# Altium schematic sheet STM32F407开发板2.SchDoc
size A3
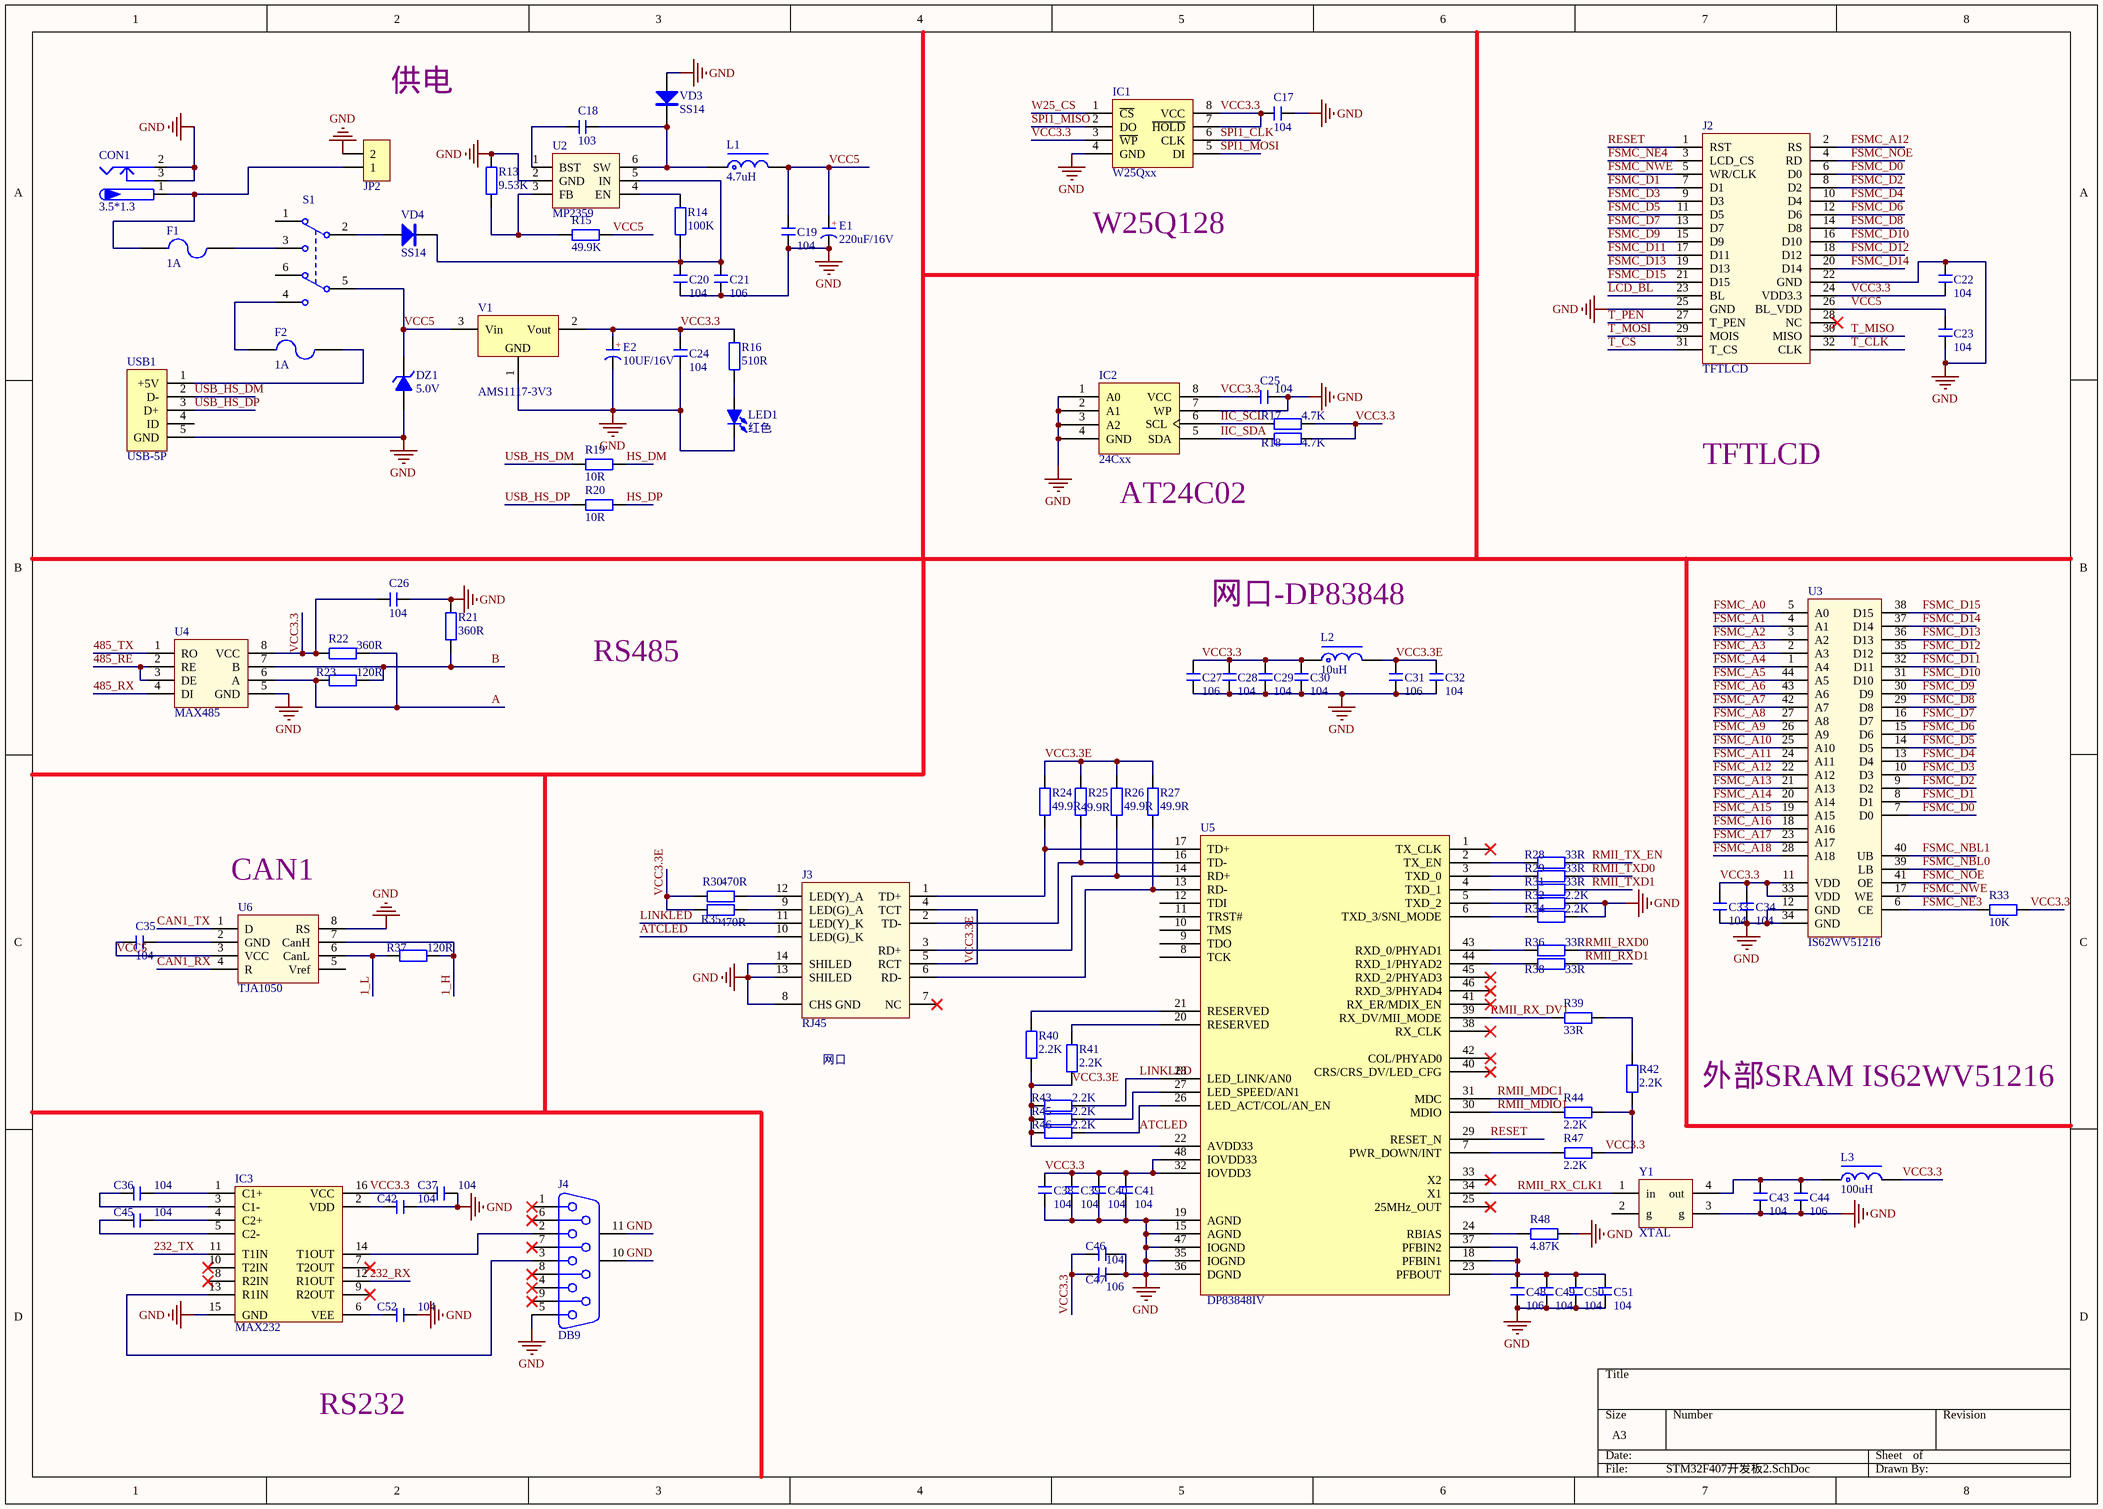
[diagram p0: STM32F407开发板2.SchDoc]

## Parts
C17  104  [C 0603]
C18  103  [C 0603]
C19  104  [C 0603]
C20  104  [C 0603]
C21  106  [C 0603]
C22  104  [C 0603]
C23  104  [C 0603]
C24  104  [C 0603]
C25  104  [C 0603]
C26  104  [C 0603]
C27  106  [C 0603]
C28  104  [C 0603]
C29  104  [C 0603]
C30  104  [C 0603]
C31  106  [C 0603]
C32  104  [C 0603]
C33  104  [C 0603]
C34  104  [C 0603]
C35  104  [C 0603]
C36  104  [C 0603]
C37  104  [C 0603]
C38  104  [C 0603]
C39  104  [C 0603]
C40  104  [C 0603]
C41  104  [C 0603]
C42  104  [C 0603]
C43  104  [C 0603]
C44  106  [C 0603]
C45  104  [C 0603]
C46  104  [C 0603]
C47  106  [C 0603]
C48  106  [C 0603]
C49  104  [C 0603]
C50  104  [C 0603]
C51  104  [C 0603]
C52  104  [C 0603]
CON1  3.5*1.3  [DC_5.5MM]
DZ1  5.0V  [MINI_MELF (LL34)]
E1  220uF/16V  [CM D(6.3*7.7)]
E2  10UF/16V  [C 1206]
F1  1A  [L 1206]
F2  1A  [L 1206]
IC1  W25Qxx  [SOP8W_L]
IC2  24Cxx  [SOP8_L]
IC3  MAX232  [SOP16_L]
J2  TFTLCD  [HDR-16X2]
J3  RJ45  [HR911105A]
J4  DB9  [DB9/P_A]
JP2  HDR-1X2  [KF301-2P]  (value not drawn)
L1  4.7uH  [L 0603]
L2  10uH  [L 0603]
L3  100uH  [L 0603]
LED1  红色  [LED 0603R]
R13  9.53K  [R 0603]
R14  100K  [R 0603]
R15  49.9K  [R 0603]
R16  510R  [R 0603]
R17  4.7K  [R 0603]
R18  4.7K  [R 0603]
R19  10R  [R 0603]
R20  10R  [R 0603]
R21  360R  [R 0603]
R22  360R  [R 0603]
R23  120R  [R 0603]
R24  49.9R  [R 0603]
R25  49.9R  [R 0603]
R26  49.9R  [R 0603]
R27  49.9R  [R 0603]
R28  33R  [R 0603]
R29  33R  [R 0603]
R30  470R  [R 0603]
R31  33R  [R 0603]
R32  2.2K  [R 0603]
R33  10K  [R 0603]
R34  2.2K  [R 0603]
R35  470R  [R 0603]
R36  33R  [R 0603]
R37  120R  [R 0603]
R38  33R  [R 0603]
R39  33R  [R 0603]
R40  2.2K  [R 0603]
R41  2.2K  [R 0603]
R42  2.2K  [R 0603]
R43  2.2K  [R 0603]
R44  2.2K  [R 0603]
R45  2.2K  [R 0603]
R46  2.2K  [R 0603]
R47  2.2K  [R 0603]
R48  4.87K  [R 0603]
S1  SK-22D02  [KFT DIP-8X8]  (value not drawn)
U2  MP2359  [MP2359]
U3  IS62WV51216  [IS62WV51216]
U4  MAX485  [MAX485]
U5  DP83848IV  [LQFP48 7X7_L]
U6  TJA1050  [TJA1050]
USB1  USB-5P  [USB-MINI-A]
V1  AMS1117-3V3  [SOT223_L]
VD3  SS14  [SOD-123]
VD4  SS14  [SOD-123]
Y1  XTAL  [XTAL-5032]

## Nets
GND: C17.1 C19.1 C20.1 C21.1 C22.1 C23.2 C24.1 C25.1 C26.1 C27.2 C28.2 C29.2 C30.2 C31.2 C32.2 C33.2 C34.2 C37.1 C38.2 C39.2 C40.2 C41.2 C42.1 C43.2 C44.2 C46.2 C47.2 C48.2 C49.2 C50.2 C51.2 C52.1 CON1.2 CON1.3 DZ1.1(A) E1.2(K) E2.2(K) IC1.4(GND) IC2.1(A0) IC2.2(A1) IC2.3(A2) IC2.4(GND) IC2.7(WP) IC3.15(GND) J2.22(GND) J2.25(GND) J3.8(CHS_GND) J3.13(SHILED) J3.14(SHILED) J4.5 J4.10(MH1) J4.11(MH2) JP2.2 LED1.2(K) R13.2 R21.1 R32.2 R34.2 R48.2 U2.2(GND) U3.12(GND) U3.34(GND) U4.5(GND) U5.15(AGND) U5.19(AGND) U5.35(IOGND) U5.36(DGND) U5.47(IOGND) U6.8(RS) USB1.5(GND) V1.1(GND) VD3.1(A) Y1.3(g)
1_H: R37.1 U6.7(CanH)
1_L: R37.2 U6.6(CanL)
232_RX: IC3.12(R1OUT)
232_TX: IC3.11(T1IN)
485_RE: U4.2(RE) U4.3(DE)
485_RX: U4.4(DI)
485_TX: U4.1(RO)
A: R22.1 R23.2 U4.6(A)
ATCLED: J3.10(LED(G)_K) R46.1 U5.26(LED_ACT/COL/AN_EN)
B: R21.2 R23.1 U4.7(B)
CAN1_RX: U6.4(R)
CAN1_TX: U6.1(D)
FSMC_A0: U3.5(A0)
FSMC_A1: U3.4(A1)
FSMC_A2: U3.3(A2)
FSMC_A3: U3.2(A3)
FSMC_A4: U3.1(A4)
FSMC_A5: U3.44(A5)
FSMC_A6: U3.43(A6)
FSMC_A7: U3.42(A7)
FSMC_A8: U3.27(A8)
FSMC_A9: U3.26(A9)
FSMC_A10: U3.25(A10)
FSMC_A11: U3.24(A11)
FSMC_A12: J2.2(RS) U3.22(A12)
FSMC_A13: U3.21(A13)
FSMC_A14: U3.20(A14)
FSMC_A15: U3.19(A15)
FSMC_A16: U3.18(A16)
FSMC_A17: U3.23(A17)
FSMC_A18: U3.28(A18)
FSMC_D0: J2.6(D0) U3.7(D0)
FSMC_D1: J2.7(D1) U3.8(D1)
FSMC_D2: J2.8(D2) U3.9(D2)
FSMC_D3: J2.9(D3) U3.10(D3)
FSMC_D4: J2.10(D4) U3.13(D4)
FSMC_D5: J2.11(D5) U3.14(D5)
FSMC_D6: J2.12(D6) U3.15(D6)
FSMC_D7: J2.13(D7) U3.16(D7)
FSMC_D8: J2.14(D8) U3.29(D8)
FSMC_D9: J2.15(D9) U3.30(D9)
FSMC_D10: J2.16(D10) U3.31(D10)
FSMC_D11: J2.17(D11) U3.32(D11)
FSMC_D12: J2.18(D12) U3.35(D12)
FSMC_D13: J2.19(D13) U3.36(D13)
FSMC_D14: J2.20(D14) U3.37(D14)
FSMC_D15: J2.21(D15) U3.38(D15)
FSMC_NBL0: U3.39(LB)
FSMC_NBL1: U3.40(UB)
FSMC_NE3: R33.2 U3.6(CE)
FSMC_NE4: J2.3(LCD_CS)
FSMC_NOE: J2.4(RD) U3.41(OE)
FSMC_NWE: J2.5(WR/CLK) U3.17(WE)
HS_DM: R19.1
HS_DP: R20.1
IIC_SCL: IC2.6(SCL) R17.2
IIC_SDA: IC2.5(SDA) R18.2
LCD_BL: J2.23(BL)
LINKLED: J3.11(LED(Y)_K) R43.1 U5.28(LED_LINK/AN0)
RESET: J2.1(RST) U5.29(RESET_N)
RMII_MDC1: U5.31(MDC)
RMII_MDIO1: R44.1 U5.30(MDIO)
RMII_RX_CLK1: U5.34(X1) Y1.1(in)
RMII_RX_DV1: R39.1 U5.39(RX_DV/MII_MODE)
RMII_RXD0: R36.2
RMII_RXD1: R38.2
RMII_TX_EN: R28.2
RMII_TXD0: R29.2
RMII_TXD1: R31.2
SPI1_CLK: IC1.6(CLK)
SPI1_MISO: IC1.2(DO)
SPI1_MOSI: IC1.5(DI)
T_CLK: J2.32(CLK)
T_CS: J2.31(T_CS)
T_MISO: J2.30(MISO)
T_MOSI: J2.29(MOIS)
T_PEN: J2.27(T_PEN)
USB_HS_DM: R19.2 USB1.2(D-)
USB_HS_DP: R20.2 USB1.3(D+)
VCC3.3: C17.2 C22.2 C24.2 C25.2 C26.2 C27.1 C28.1 C29.1 C30.1 C33.1 C34.1 C37.2 C38.1 C39.1 C40.1 C41.1 C46.1 C47.1 E2.1(A) IC1.3(~{WP}) IC1.7(~{HOLD}) IC1.8(VCC) IC2.8(VCC) IC3.16(VCC) J2.24(VDD3.3) L2.1 L3.2 R16.2 R17.1 R18.1 R22.2 R33.1 R42.1 R44.2 R47.2 U3.11(VDD) U3.33(VDD) U4.8(VCC) U5.32(IOVDD3) U5.48(IOVDD33) V1.2(Vout)
VCC3.3E: C31.1 C32.1 J3.4(TCT) J3.5(RCT) L2.2 R24.1 R25.1 R26.1 R27.1 R30.2 R35.2 R40.2 R41.2 R43.2 R45.2 R46.2 U5.22(AVDD33)
VCC5: C19.2 C23.1 C35.2 DZ1.2(K) E1.1(A) J2.26(BL_VDD) L1.2 R15.1 S1.5 U6.3(VCC) V1.3(Vin)
W25_CS: IC1.1(~{CS})
NetC18_1: C18.1 L1.1 U2.6(SW) VD3.2(K)
NetC18_2: C18.2 U2.1(BST)
NetC20_2: C20.2 C21.2 R14.2 U2.5(IN) VD4.2(K)
NetC35_1: C35.1 U6.2(GND)
NetC36_1: C36.1 IC3.1(C1+)
NetC36_2: C36.2 IC3.3(C1-)
NetC42_2: C42.2 IC3.2(VDD)
NetC43_1: C43.1 C44.1 L3.1 Y1.4(out)
NetC45_1: C45.1 IC3.4(C2+)
NetC45_2: C45.2 IC3.5(C2-)
NetC48_1: C48.1 C49.1 C50.1 C51.1 U5.18(PFBIN1) U5.23(PFBOUT) U5.37(PFBIN2)
NetC52_2: C52.2 IC3.6(VEE)
NetCON1_1: CON1.1 F1.1 JP2.1
NetF1_2: F1.2 S1.3
NetF2_1: F2.1 S1.4
NetF2_2: F2.2 USB1.1(+5V)
NetIC3_13: IC3.13(R1IN) J4.3
NetIC3_14: IC3.14(T1OUT) J4.2
NetJ3_1: J3.1(TD+) R24.2 U5.17(TD+)
NetJ3_2: J3.2(TD-) R25.2 U5.16(TD-)
NetJ3_3: J3.3(RD+) R26.2 U5.14(RD+)
NetJ3_6: J3.6(RD-) R27.2 U5.13(RD-)
NetJ3_9: J3.9(LED(G)_A) R35.1
NetJ3_12: J3.12(LED(Y)_A) R30.1
NetLED1_1: LED1.1(A) R16.1
NetR13_1: R13.1 R15.2 U2.3(FB)
NetR14_1: R14.1 U2.4(EN)
NetR28_1: R28.1 U5.2(TX_EN)
NetR29_1: R29.1 U5.3(TXD_0)
NetR31_1: R31.1 U5.4(TXD_1)
NetR32_1: R32.1 U5.5(TXD_2)
NetR34_1: R34.1 U5.6(TXD_3/SNI_MODE)
NetR36_1: R36.1 U5.43(RXD_0/PHYAD1)
NetR38_1: R38.1 U5.44(RXD_1/PHYAD2)
NetR39_2: R39.2 R42.2
NetR40_1: R40.1 U5.21(RESERVED)
NetR41_1: R41.1 U5.20(RESERVED)
NetR45_1: R45.1 U5.27(LED_SPEED/AN1)
NetR47_1: R47.1 U5.7(PWR_DOWN/INT)
NetR48_1: R48.1 U5.24(RBIAS)
NetS1_2: S1.2 VD4.1(A)

Not connected (* = marked no-connect by the designer): IC3 7(T2OUT)* 8(R2IN)* 9(R2OUT)* 10(T2IN)*; J2 28(NC)*; J3 7(NC)*; J4 1* 4* 6* 7* 8* 9*; S1 1 6; U5 1(TX_CLK)* 8(TCK) 9(TDO) 10(TMS) 11(TRST#) 12(TDI) 25(25MHz_OUT)* 33(X2)* 38(RX_CLK)* 40(CRS/CRS_DV/LED_CFG)* 41(RX_ER/MDIX_EN)* 42(COL/PHYAD0)* 45(RXD_2/PHYAD3)* 46(RXD_3/PHYAD4)*; U6 5(Vref); USB1 4(ID); Y1 2(g)

## Notes on the sheet
- 供电
- (near IC1) W25Q128
- AT24C02
- TFTLCD
- 网口-DP83848
- RS485
- (near U6) CAN1
- (near J3) 网口
- 外部SRAM IS62WV51216
- RS232
- (in symbol C-CAP) +

## Library data of the parts
C17-C52 = C: 无极性贴片电容; 版权归属: 源创客; BOM名称: 无极性贴片电容; 学习资源: www.ooocke.com
CON1 = P-DC: 低压电源接口; BOM名称: DC电源接口; 版权归属: 源创客; 学习资源: www.ooocke.com
DZ1 = 1N4106: 12V/0.5W稳压管; 版权归属: 源创客; BOM名称: 12V/0.5W稳压管; 学习资源: www.ooocke.com
E1 E2 = C-CAP: 直插电解电容; 版权归属: 源创客; BOM名称: 直插电解电容; 学习资源: www.ooocke.com
F1 F2 = FU 5x20: 5*20保险丝; 版权归属: 源创客; BOM名称: 5*20保险丝; 学习资源: www.ooocke.com
IC1 = W25Qxx: 外置Flash; 版权归属: 源创客; BOM名称: 外置Flash; 学习资源: www.ooocke.com
IC2 = 24Cxx: 外置EEPROM; 版权归属: 源创客; BOM名称: 外置EEPROM; 学习资源: www.ooocke.com
IC3 = MAX232: 版权归属: 源创客; BOM名称: MAX232; 学习资源: www.ooocke.com
J4 = DB9: 9针串口; 版权归属: 源创客; BOM名称: 9针串口; 学习资源: www.ooocke.com
JP2 = Header 2: 2P接插件; 版权归属: 源创客; BOM名称: 2P接插件; 学习资源: www.ooocke.com
L1-L3 = L: 小功率贴片电感; 版权归属: 源创客; BOM名称: 小功率贴片电感; 学习资源: www.ooocke.com
LED1 = LED-5MM: 5mm插件LED; 版权归属: 源创客; BOM名称: 5mm插件LED; 学习资源: www.ooocke.com
R13-R48 = R: 贴片电阻; 版权归属: 源创客; BOM名称: 贴片电阻; 学习资源: www.ooocke.com
S1 = SSW-2P: 2路波动开关; BOM名称: 波动开关; 版权归属: 源创客; 学习资源: www.ooocke.com
USB1 = USB-5P: 微型USB母座; 版权归属: 源创客; BOM名称: 微型USB母座; 学习资源: www.ooocke.com
V1 = AMS1117: 三端稳压芯片; BOM名称: 稳压芯片; 版权归属: 源创客; 学习资源: www.ooocke.com
VD3 VD4 = SS14: 肖特基二极管; 版权归属: 源创客; 属性: 40V/1A; BOM名称: 肖特基二极管; 学习资源: www.ooocke.com